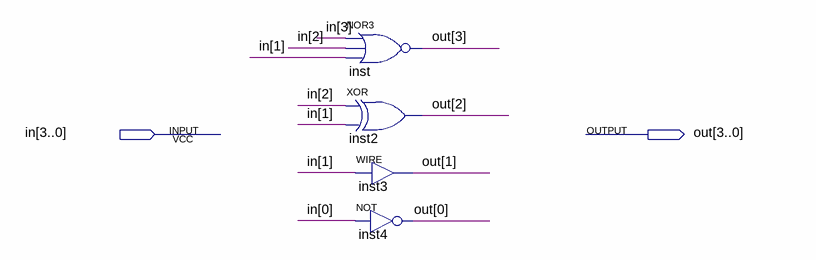
[diagram p0: schematic sheet]
// Quartus schematic BCDInverter.bdf as structural Verilog: 4 symbols, 2 pins
module BCDInverter (
  input  [3:0] in,
  output [3:0] out
);

  nor inst (out[3], in[3], in[2], in[1]);
  xor inst2 (out[2], in[2], in[1]);
  assign out[1] = in[1];  // WIRE inst3
  not inst4 (out[0], in[0]);
endmodule
